# EAGLE schematic SparkFun_Photon_Wearable_Shield (EAGLE 7.1.0)
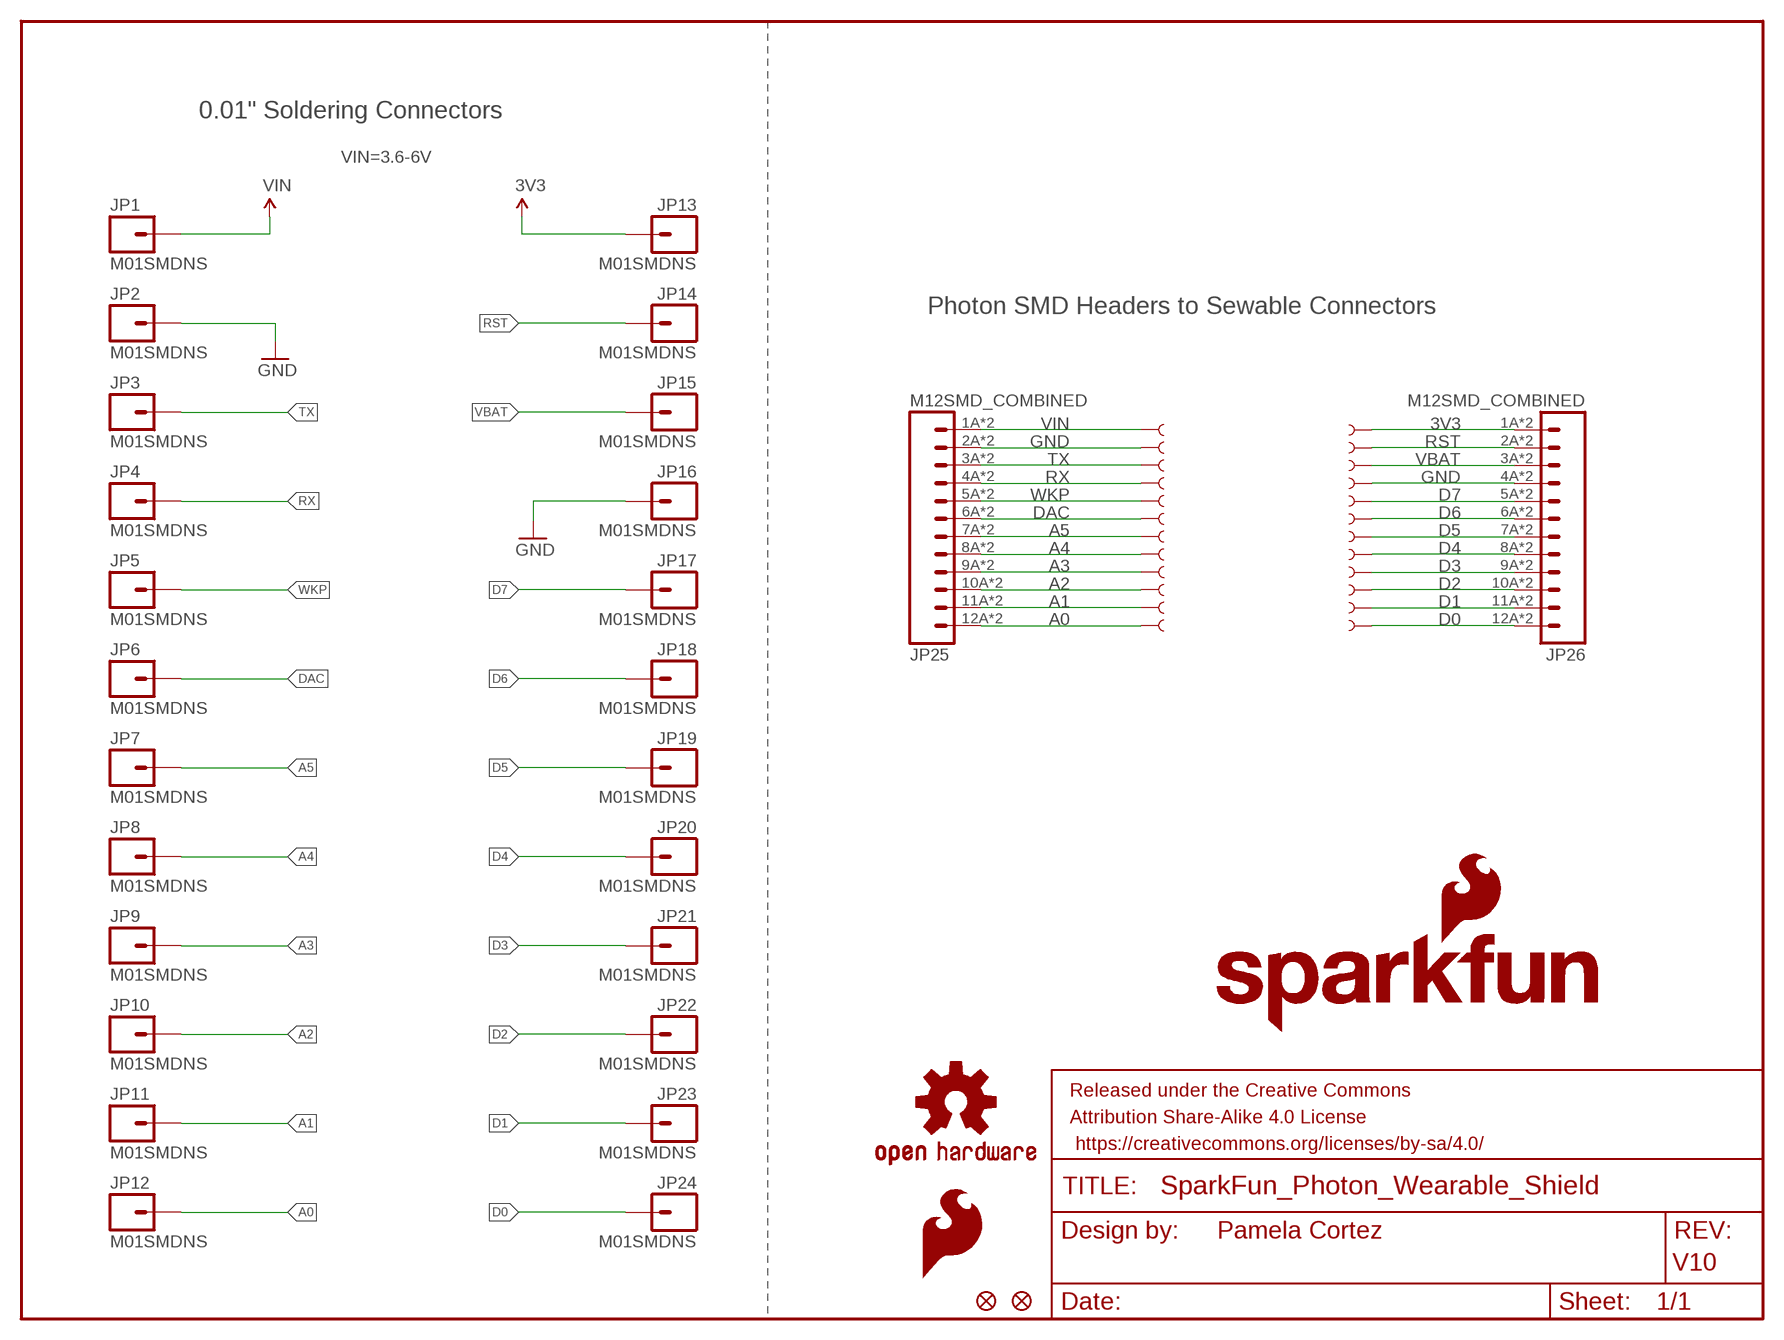
[diagram p0: schematic, sheet 1]

## Parts
FID1  FIDUCIAL1X2  [FIDUCIAL-1X2]
FID2  FIDUCIAL1X2  [FIDUCIAL-1X2]
FRAME1  FRAME-LETTER  [CREATIVE_COMMONS]
J1  PAD  [PAD-LONG-2-SIDED]
J2  PAD  [PAD-LONG-2-SIDED]
J3  PAD  [PAD-LONG-2-SIDED]
J4  PAD  [PAD-LONG-2-SIDED]
J5  PAD  [PAD-LONG-2-SIDED]
J6  PAD  [PAD-LONG-2-SIDED]
J7  PAD  [PAD-LONG-2-SIDED]
J8  PAD  [PAD-LONG-2-SIDED]
J9  PAD  [PAD-LONG-2-SIDED]
J10  PAD  [PAD-LONG-2-SIDED]
J11  PAD  [PAD-LONG-2-SIDED]
J12  PAD  [PAD-LONG-2-SIDED]
J13  PAD  [PAD-LONG-2-SIDED]
J14  PAD  [PAD-LONG-2-SIDED]
J15  PAD  [PAD-LONG-2-SIDED]
J16  PAD  [PAD-LONG-2-SIDED]
J17  PAD  [PAD-LONG-2-SIDED]
J18  PAD  [PAD-LONG-2-SIDED]
J19  PAD  [PAD-LONG-2-SIDED]
J20  PAD  [PAD-LONG-2-SIDED]
J21  PAD  [PAD-LONG-2-SIDED]
J22  PAD  [PAD-LONG-2-SIDED]
J23  PAD  [PAD-LONG-2-SIDED]
J24  PAD  [PAD-LONG-2-SIDED]
JP1  M01SMDNS  [1X01NS]
JP2  M01SMDNS  [1X01NS]
JP3  M01SMDNS  [1X01NS]
JP4  M01SMDNS  [1X01NS]
JP5  M01SMDNS  [1X01NS]
JP6  M01SMDNS  [1X01NS]
JP7  M01SMDNS  [1X01NS]
JP8  M01SMDNS  [1X01NS]
JP9  M01SMDNS  [1X01NS]
JP10  M01SMDNS  [1X01NS]
JP11  M01SMDNS  [1X01NS]
JP12  M01SMDNS  [1X01NS]
JP13  M01SMDNS  [1X01NS]
JP14  M01SMDNS  [1X01NS]
JP15  M01SMDNS  [1X01NS]
JP16  M01SMDNS  [1X01NS]
JP17  M01SMDNS  [1X01NS]
JP18  M01SMDNS  [1X01NS]
JP19  M01SMDNS  [1X01NS]
JP20  M01SMDNS  [1X01NS]
JP21  M01SMDNS  [1X01NS]
JP22  M01SMDNS  [1X01NS]
JP23  M01SMDNS  [1X01NS]
JP24  M01SMDNS  [1X01NS]
JP25  M12SMD_COMBINED  [1X12_SMD_COMBINED]
JP26  M12SMD_COMBINED  [1X12_SMD_COMBINED]
LOGO1  SFE_LOGO_FLAME.2_INCH  [SFE_LOGO_FLAME_.2]
LOGO2  OSHW-LOGOM  [OSHW-LOGO-M]
LOGO3  SFE_LOGO_NAME_FLAME.1_INCH  [SFE_LOGO_NAME_FLAME_.1]

## Nets
3V3: J13.1 JP13.1 JP26.1A JP26.1B
A0: J12.1 JP12.1 JP25.12A JP25.12B
A1: J11.1 JP11.1 JP25.11A JP25.11B
A2: J10.1 JP10.1 JP25.10A JP25.10B
A3: J9.1 JP9.1 JP25.9A JP25.9B
A4: J8.1 JP8.1 JP25.8A JP25.8B
A5: J7.1 JP7.1 JP25.7A JP25.7B
D0: J24.1 JP24.1 JP26.12A JP26.12B
D1: J23.1 JP23.1 JP26.11A JP26.11B
D2: J22.1 JP22.1 JP26.10A JP26.10B
D3: J21.1 JP21.1 JP26.9A JP26.9B
D4: J20.1 JP20.1 JP26.8A JP26.8B
D5: J19.1 JP19.1 JP26.7A JP26.7B
D6: J18.1 JP18.1 JP26.6A JP26.6B
D7: J17.1 JP17.1 JP26.5A JP26.5B
DAC: J6.1 JP6.1 JP25.6A JP25.6B
GND: J2.1 J16.1 JP2.1 JP16.1 JP25.2A JP25.2B JP26.4A JP26.4B
RST: J14.1 JP14.1 JP26.2A JP26.2B
RX: J4.1 JP4.1 JP25.4A JP25.4B
TX: J3.1 JP3.1 JP25.3A JP25.3B
VBAT: J15.1 JP15.1 JP26.3A JP26.3B
VIN: J1.1 JP1.1 JP25.1A JP25.1B
WKP: J5.1 JP5.1 JP25.5A JP25.5B

## Notes on the sheet
- 0.01" Soldering Connectors
- VIN=3.6-6V
- Photon SMD Headers to Sewable Connectors
- Pamela Cortez
- V10

## Library data of the parts
FID1 FID2 = SparkFun-Aesthetics:FIDUCIAL: Fiducial Alignment Points Various fiducial points for machine vision alignment.
FRAME1 = SparkFun-Aesthetics:FRAME-LETTER: Schematic Frame Standard 8.5x11 US Letter frame; DESIGNER: NAME; VERSION: v01
J1-J24 = Photon_wearable:PAD
JP1-JP24 = SparkFun-Connectors:M01: Header 1 Standard 1-pin 0.1" header. Use with straight break away headers (SKU : PRT-00116), right angle break away headers (PRT-00553), swiss pins (PRT-00743), machine pins (PRT-00117), and female headers (PRT-00115).
JP25 JP26 = SparkFun-Connectors:M12: Header 12 Standard 12-pin 0.1" header. Use with straight break away headers (SKU : PRT-00116), right angle break away headers (PRT-00553), swiss pins (PRT-00743), machine pins (PRT-00117), and female headers (PRT-00115).; PROD_ID: CONN-12614
LOGO1 = SparkFun-Aesthetics:SFE_LOGO_FLAME: SFE Logo, flame only This is the SparkFun flame logo. The logo on the schematic will always be the same size; the package variant is the height of the flame. Default layer for the logo on the board is tSilk.
LOGO2 = SparkFun-Aesthetics:OSHW-LOGO: Open Source Hardware Logo This logo indicates the piece of hardware it is found on incorporates a OSHW license and/or adheres to the definition of open source hardware found here: http://freedomdefined.org/OSHW
LOGO3 = SparkFun-Aesthetics:SFE_LOGO_NAME_FLAME: SFE Logo, name and flame This is the SparkFun full logo. The logo on the schematic will always be the same size; the package variant is the height of the flame part of the logo. Default layer for the logo on the board is tSilk.